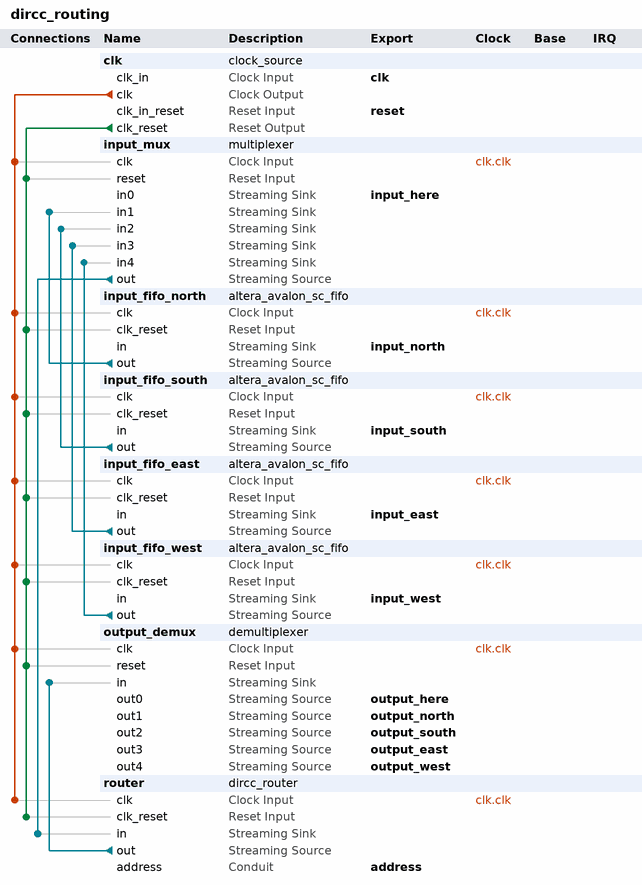
[diagram p0: system contents]
# Platform Designer (Qsys) system dircc_routing, Cyclone V 5CSEMA5F31C6
# Parameters at their usual value, and those the tool derives, are not listed.
package require -exact qsys 16.1
create_system dircc_routing
set_project_property DEVICE_FAMILY {Cyclone V}
set_project_property DEVICE 5CSEMA5F31C6

add_instance clk clock_source 16.1
set_instance_parameter_value clk clockFrequency 50000000
set_instance_parameter_value clk resetSynchronousEdges DEASSERT

add_instance input_mux multiplexer 16.1
set_instance_parameter_value input_mux bitsPerSymbol 8
set_instance_parameter_value input_mux errorWidth 0
set_instance_parameter_value input_mux numInputInterfaces 5
set_instance_parameter_value input_mux outChannelWidth 3
set_instance_parameter_value input_mux packetScheduling true
set_instance_parameter_value input_mux schedulingSize 2
set_instance_parameter_value input_mux symbolsPerBeat 4
set_instance_parameter_value input_mux useHighBitsOfChannel true
set_instance_parameter_value input_mux usePackets true

add_instance input_fifo_north altera_avalon_sc_fifo 16.1
set_instance_parameter_value input_fifo_north BITS_PER_SYMBOL 8
set_instance_parameter_value input_fifo_north CHANNEL_WIDTH 0
set_instance_parameter_value input_fifo_north ERROR_WIDTH 0
set_instance_parameter_value input_fifo_north FIFO_DEPTH 16
set_instance_parameter_value input_fifo_north SYMBOLS_PER_BEAT 4
set_instance_parameter_value input_fifo_north USE_FILL_LEVEL 0
set_instance_parameter_value input_fifo_north USE_MEMORY_BLOCKS 1
set_instance_parameter_value input_fifo_north USE_PACKETS 1
set_instance_parameter_value input_fifo_north USE_STORE_FORWARD 0

add_instance input_fifo_south altera_avalon_sc_fifo 16.1
set_instance_parameter_value input_fifo_south BITS_PER_SYMBOL 8
set_instance_parameter_value input_fifo_south CHANNEL_WIDTH 0
set_instance_parameter_value input_fifo_south ERROR_WIDTH 0
set_instance_parameter_value input_fifo_south FIFO_DEPTH 16
set_instance_parameter_value input_fifo_south SYMBOLS_PER_BEAT 4
set_instance_parameter_value input_fifo_south USE_FILL_LEVEL 0
set_instance_parameter_value input_fifo_south USE_MEMORY_BLOCKS 1
set_instance_parameter_value input_fifo_south USE_PACKETS 1
set_instance_parameter_value input_fifo_south USE_STORE_FORWARD 0

add_instance input_fifo_east altera_avalon_sc_fifo 16.1
set_instance_parameter_value input_fifo_east BITS_PER_SYMBOL 8
set_instance_parameter_value input_fifo_east CHANNEL_WIDTH 0
set_instance_parameter_value input_fifo_east ERROR_WIDTH 0
set_instance_parameter_value input_fifo_east FIFO_DEPTH 16
set_instance_parameter_value input_fifo_east SYMBOLS_PER_BEAT 4
set_instance_parameter_value input_fifo_east USE_FILL_LEVEL 0
set_instance_parameter_value input_fifo_east USE_MEMORY_BLOCKS 1
set_instance_parameter_value input_fifo_east USE_PACKETS 1
set_instance_parameter_value input_fifo_east USE_STORE_FORWARD 0

add_instance input_fifo_west altera_avalon_sc_fifo 16.1
set_instance_parameter_value input_fifo_west BITS_PER_SYMBOL 8
set_instance_parameter_value input_fifo_west CHANNEL_WIDTH 0
set_instance_parameter_value input_fifo_west ERROR_WIDTH 0
set_instance_parameter_value input_fifo_west FIFO_DEPTH 16
set_instance_parameter_value input_fifo_west SYMBOLS_PER_BEAT 4
set_instance_parameter_value input_fifo_west USE_FILL_LEVEL 0
set_instance_parameter_value input_fifo_west USE_MEMORY_BLOCKS 1
set_instance_parameter_value input_fifo_west USE_PACKETS 1
set_instance_parameter_value input_fifo_west USE_STORE_FORWARD 0

add_instance output_demux demultiplexer 16.1
set_instance_parameter_value output_demux bitsPerSymbol 8
set_instance_parameter_value output_demux errorWidth 0
set_instance_parameter_value output_demux inChannelWidth 3
set_instance_parameter_value output_demux numOutputInterfaces 5
set_instance_parameter_value output_demux symbolsPerBeat 4
set_instance_parameter_value output_demux useHighBitsOfChannel true
set_instance_parameter_value output_demux usePackets true

add_instance router dircc_router 1.0
set_instance_parameter_value router BITS_PER_SYMBOL 8
set_instance_parameter_value router CHANNEL_WIDTH 3
set_instance_parameter_value router ERROR_WIDTH 0
set_instance_parameter_value router MAX_ROUTE_DIRECTION 5
set_instance_parameter_value router PIPELINE_READY 1
set_instance_parameter_value router SYMBOLS_PER_BEAT 4
set_instance_parameter_value router USE_EMPTY true
set_instance_parameter_value router USE_HIGH_BIT_SELECT true
set_instance_parameter_value router USE_PACKETS true
set_instance_parameter_value router maxChannel 7

# connections
add_connection clk.clk input_fifo_east.clk clock
add_connection clk.clk input_fifo_north.clk clock
add_connection clk.clk input_fifo_south.clk clock
add_connection clk.clk input_fifo_west.clk clock
add_connection clk.clk input_mux.clk clock
add_connection clk.clk output_demux.clk clock
add_connection clk.clk router.clk clock
add_connection clk.clk_reset input_fifo_east.clk_reset reset
add_connection clk.clk_reset input_fifo_north.clk_reset reset
add_connection clk.clk_reset input_fifo_south.clk_reset reset
add_connection clk.clk_reset input_fifo_west.clk_reset reset
add_connection clk.clk_reset input_mux.reset reset
add_connection clk.clk_reset output_demux.reset reset
add_connection clk.clk_reset router.clk_reset reset
add_connection input_fifo_east.out input_mux.in3 avalon_streaming
add_connection input_fifo_north.out input_mux.in1 avalon_streaming
add_connection input_fifo_south.out input_mux.in2 avalon_streaming
add_connection input_fifo_west.out input_mux.in4 avalon_streaming
add_connection input_mux.out router.in avalon_streaming
add_connection router.out output_demux.in avalon_streaming

# exported interfaces
add_interface address conduit end
set_interface_property address EXPORT_OF router.address
add_interface clk clock sink
set_interface_property clk EXPORT_OF clk.clk_in
add_interface input_east avalon_streaming sink
set_interface_property input_east EXPORT_OF input_fifo_east.in
add_interface input_here avalon_streaming sink
set_interface_property input_here EXPORT_OF input_mux.in0
add_interface input_north avalon_streaming sink
set_interface_property input_north EXPORT_OF input_fifo_north.in
add_interface input_south avalon_streaming sink
set_interface_property input_south EXPORT_OF input_fifo_south.in
add_interface input_west avalon_streaming sink
set_interface_property input_west EXPORT_OF input_fifo_west.in
add_interface output_east avalon_streaming source
set_interface_property output_east EXPORT_OF output_demux.out3
add_interface output_here avalon_streaming source
set_interface_property output_here EXPORT_OF output_demux.out0
add_interface output_north avalon_streaming source
set_interface_property output_north EXPORT_OF output_demux.out1
add_interface output_south avalon_streaming source
set_interface_property output_south EXPORT_OF output_demux.out2
add_interface output_west avalon_streaming source
set_interface_property output_west EXPORT_OF output_demux.out4
add_interface reset reset sink
set_interface_property reset EXPORT_OF clk.clk_in_reset

set_interconnect_requirement {$system} qsys_mm.clockCrossingAdapter HANDSHAKE
set_interconnect_requirement {$system} qsys_mm.enableEccProtection FALSE
set_interconnect_requirement {$system} qsys_mm.insertDefaultSlave FALSE
set_interconnect_requirement {$system} qsys_mm.maxAdditionalLatency 1

save_system dircc_routing.qsys
